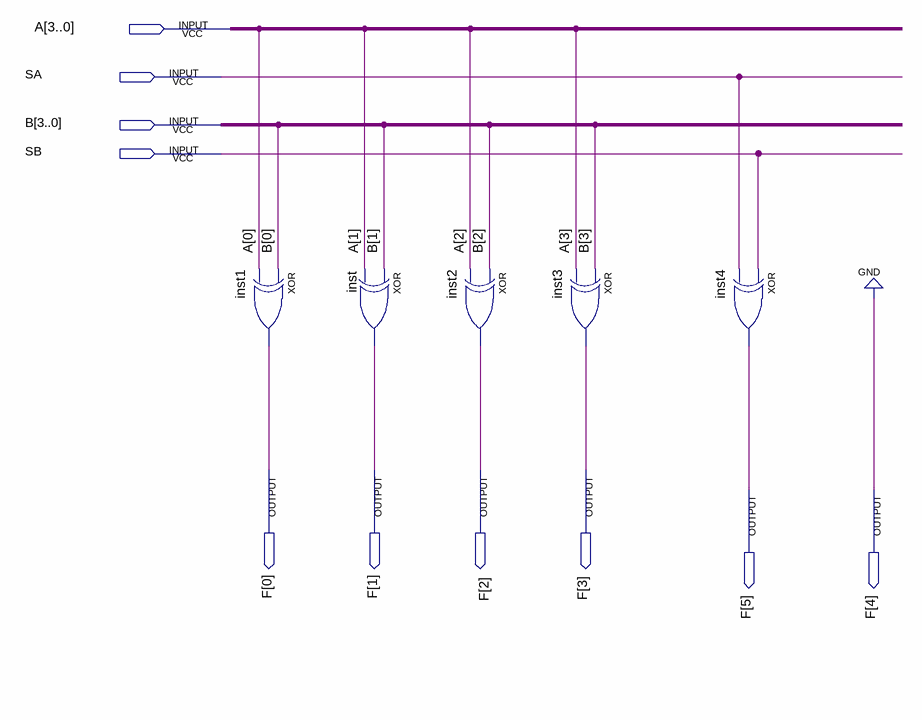
[diagram p0: schematic sheet]
// Quartus schematic op_xor.bdf as structural Verilog: 5 symbols, 10 pins
module op_xor (
  input  [3:0] A,
  input  SA,
  input  [3:0] B,
  input  SB,
  output [5:0] F
);

  xor inst1 (F[0], B[0], A[0]);
  xor inst (F[1], B[1], A[1]);
  xor inst2 (F[2], B[2], A[2]);
  xor inst3 (F[3], B[3], A[3]);
  xor inst4 (F[5], SB, SA);

  assign F[4] = 1'b0;
endmodule
